# EAGLE design ch37x-cart (EAGLE 9.6.2)
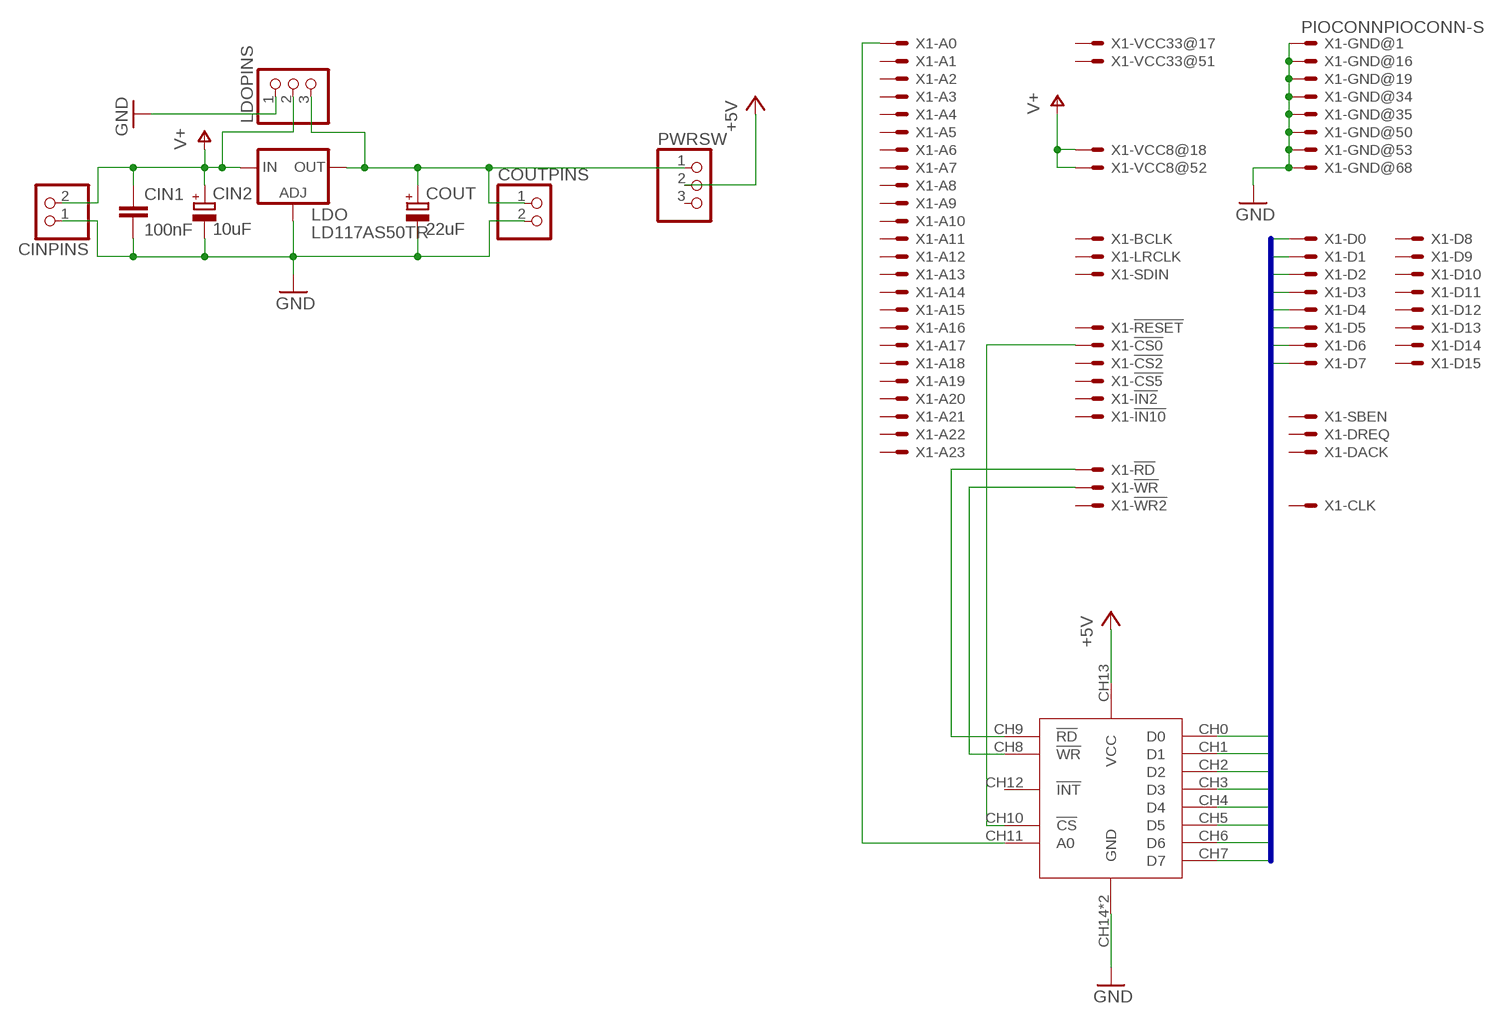
[diagram p0: schematic, sheet 1]

## Parts
CH37XBOARD  CH375B-BOARD  [CH375B-BOARD]
CIN1  100nF  C-EUC0603K  [C0603K]
CIN2  10uF  CPOL-EUA/3216-18W  [A/3216-18W]
CINPINS  PINHD-1X2  [1X02]
COUT  22uF  CPOL-EUA/3216-18W  [A/3216-18W]
COUTPINS  PINHD-1X2  [1X02]
LDO  LD117AS50TR  [SOT223]
LDOPINS  PINHD-1X3  [1X03]
PWRSW  PINHD-1X3  [1X03]
X1  PIOCONNPIOCONN-S  [PIOCONN]

## Nets
5VALWAYS: COUT.+ COUTPINS.1 LDO.4(OUT) LDOPINS.3 PWRSW.1
!CS0: CH37XBOARD.CH10(!CS) X1.4
!RD: CH37XBOARD.CH9(!RD) X1.30
!WR: CH37XBOARD.CH8(!WR) X1.64
+5V: CH37XBOARD.CH13(VCC) PWRSW.2
A0: CH37XBOARD.CH11(A0) X1.14
D0: CH37XBOARD.CH0(D0) X1.6
D1: CH37XBOARD.CH1(D1) X1.40
D2: CH37XBOARD.CH2(D2) X1.7
D3: CH37XBOARD.CH3(D3) X1.41
D4: CH37XBOARD.CH4(D4) X1.8
D5: CH37XBOARD.CH5(D5) X1.42
D6: CH37XBOARD.CH6(D6) X1.9
D7: CH37XBOARD.CH7(D7) X1.43
GND: CH37XBOARD.CH14(GND) CH37XBOARD.CH15(GND) CIN1.2 CIN2.- CINPINS.1 COUT.- COUTPINS.2 LDO.1(ADJ) LDOPINS.1 X1.1 X1.16 X1.19 X1.34 X1.35 X1.50 X1.53 X1.68
V+: CIN1.1 CIN2.+ CINPINS.2 LDO.3(IN) LDOPINS.2 X1.18 X1.52
Unconnected: CH37XBOARD.CH12(!INT) PWRSW.3 X1.2 X1.3 X1.5 X1.10 X1.11 X1.12 X1.13 X1.15 X1.17 X1.20 X1.21 X1.22 X1.23 X1.24 X1.25 X1.26 X1.27 X1.28 X1.29 X1.31 X1.32 X1.33 X1.36 X1.37 X1.38 X1.39 X1.44 X1.45 X1.46 X1.47 X1.48 X1.49 X1.51 X1.54 X1.55 X1.56 X1.57 X1.58 X1.59 X1.60 X1.61 X1.62 X1.63 X1.65 X1.66 X1.67

## Buses
D0,D1,D2,D3,D4,D5,D6,D7

## Library data of the parts
CH37XBOARD = pixel:CH375B-BOARD
CIN1 = rcl:C-EU: CAPACITOR, European symbol; SPICEPREFIX: C
CIN2 COUT = rcl:CPOL-EU: POLARIZED CAPACITOR, European symbol; SPICEPREFIX: C
CINPINS COUTPINS = pinhead:PINHD-1X2: PIN HEADER
LDO = v-reg:LD117A?*: Low drop fixed and adjustable positive voltage regulators 1 A Source: http://www.st.com/stonline/products/literature/ds/7194/ld1117axx.pdf
LDOPINS PWRSW = pinhead:PINHD-1X3: PIN HEADER
X1 = pixel:PIOCONN: CONNECTOR 68-pin 1.27mm (.050 inch) pitch SCSI+ unshielded receptacle right angle all plastic

## Board
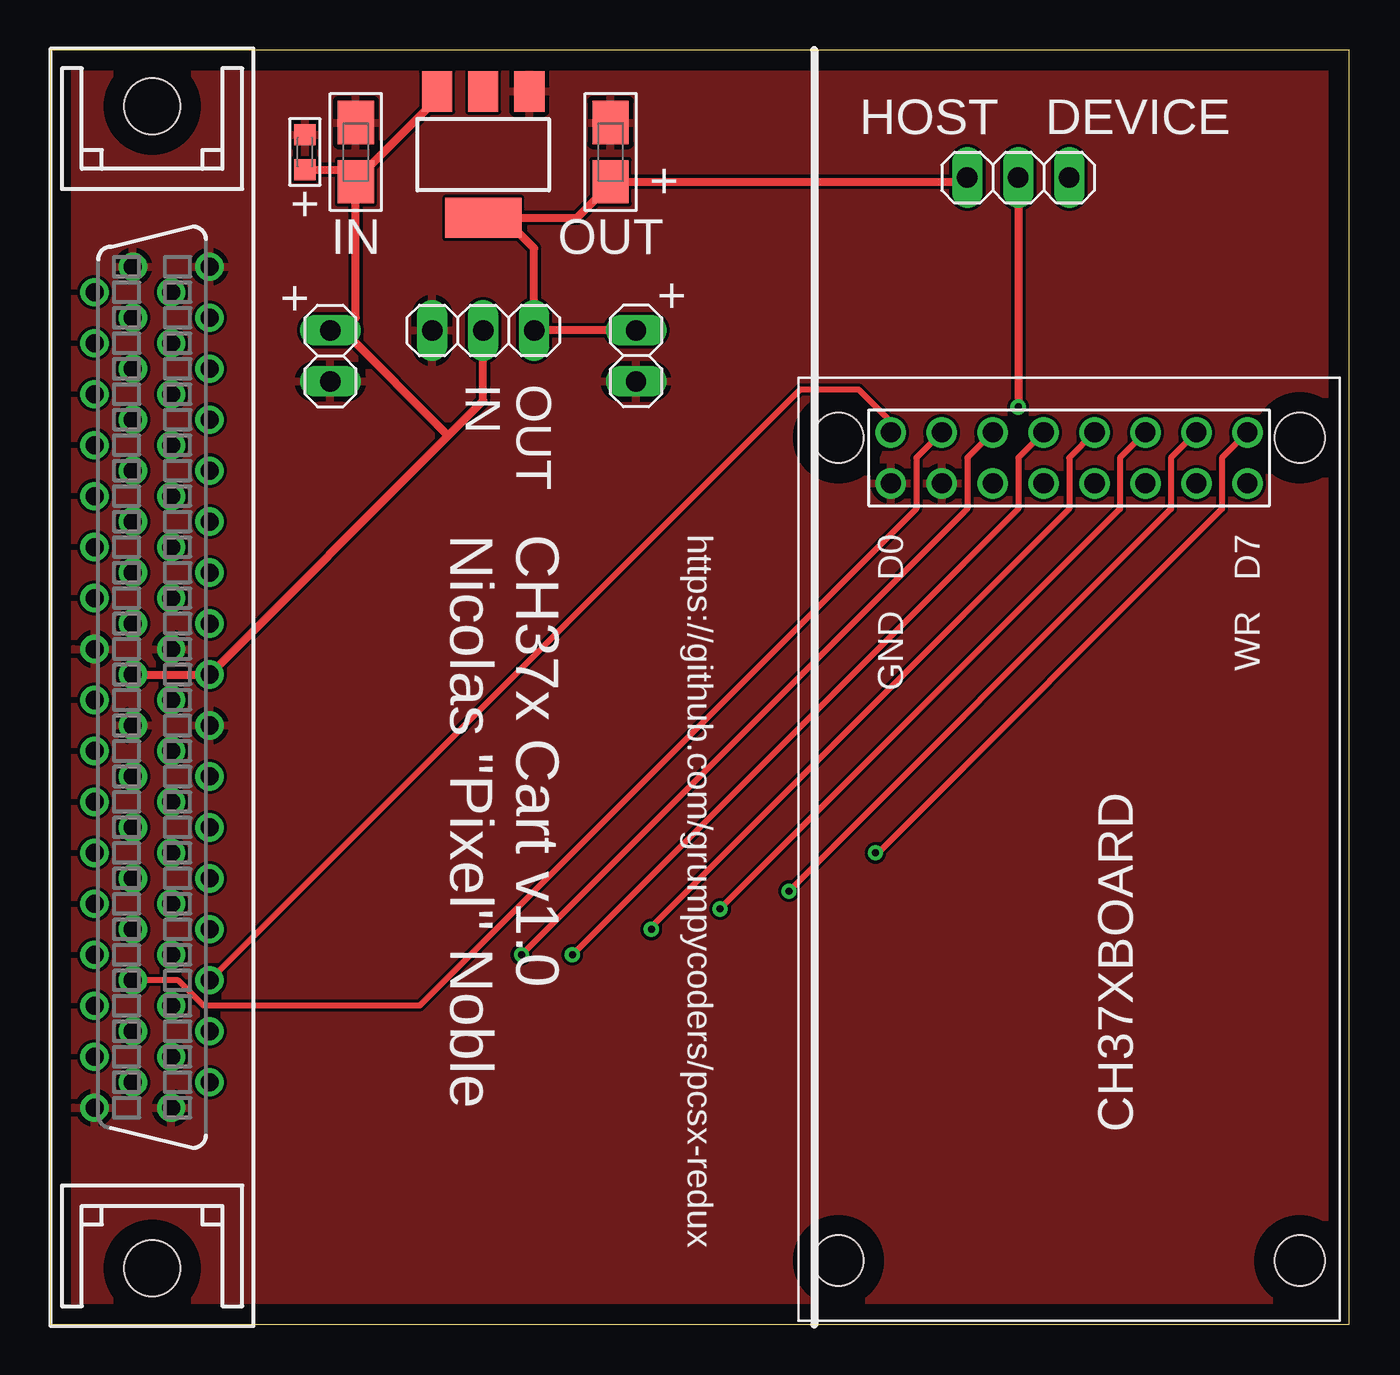
[diagram p1: board, top side]
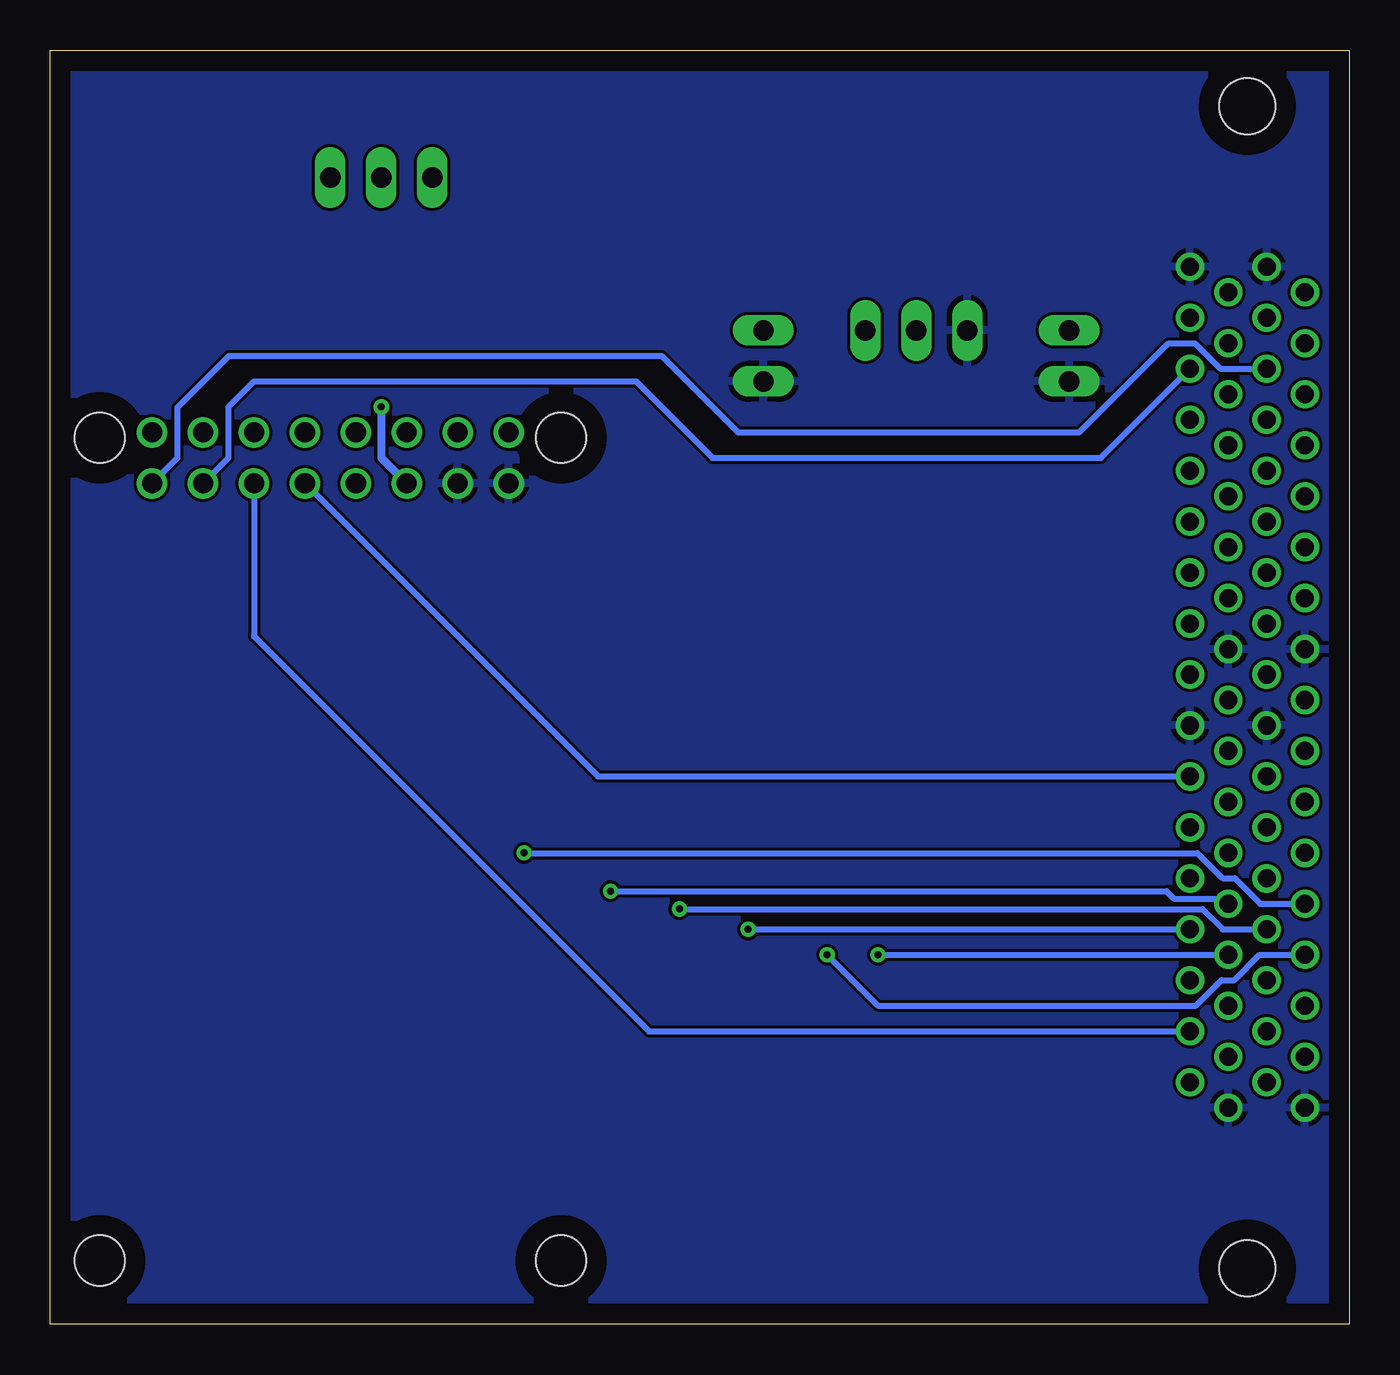
[diagram p2: board, bottom side, seen from below]

Size 64.77 x 63.5 mm. Coordinates in mm from the lower left corner, seen from the top.
Outline: 0,0 64.77,0 64.77,63.5 0,63.5 0,0
Copper layers (1*16): Top 0.035mm / dielectric 1.5mm / Bottom 0.035mm
Design rules "default": minimum track width 6mil, minimum drill 0.35mm, track to track 6mil, track to pad 6mil, pad to pad 6mil, via to via 6mil, smd to smd 6mil, copper to edge 40mil, drill to drill 6mil, minimum pad ring 10mil, minimum via ring 8mil, stop-mask expansion 4mil, vias tented up to drill 0mil, thermal gap 10mil

### Footprints (pad centres in the part's own frame; a part is rotated, then mirrored left to right if it is on the bottom)
CH375B-BOARD = drill 1: CH0 -1.27,-8.89; CH1 -1.27,-6.35; CH2 -1.27,-3.81; CH3 -1.27,-1.27; CH4 -1.27,1.27; CH5 -1.27,3.81; CH6 -1.27,6.35; CH7 -1.27,8.89; CH8 1.27,8.89; CH9 1.27,6.35; CH10 1.27,3.81; CH11 1.27,1.27; CH12 1.27,-1.27; CH13 1.27,-3.81; CH14 1.27,-6.35; CH15 1.27,-8.89 | hole 2.5: -1,11.5; -1,-11.5; 40,11.5; 40,-11.5
C0603K = smd 1.05 x 1.08: 1 -0.875,0; 2 0.875,0
A/3216-18W = smd 2.15 x 1.8: + 1.475,0; - -1.475,0
1X02 = drill 1.016 long: 1 -1.27,0; 2 1.27,0
SOT223 = smd 1.5 x 2: 1 -2.3,-3.15; 2 0,-3.15; 3 2.3,-3.15 | smd 3.8 x 2: 4 0,3.15
1X03 = drill 1.016 long: 1 -2.54,0; 2 0,0; 3 2.54,0
PIOCONN = drill 0.9 pad 1.27: 1 20.955,0.953; 2 19.685,2.863; 3 18.415,0.953; 4 17.145,2.863; 5 15.875,0.953; 6 14.605,2.863; 7 13.335,0.953; 8 12.065,2.863; 9 10.795,0.953; 10 9.525,2.863; 11 8.255,0.953; 12 6.985,2.863; 13 5.715,0.953; 14 4.445,2.863; 15 3.175,0.953; 16 1.905,2.863; 17 0.635,0.953; 18 -0.635,2.863; 19 -1.905,0.953; 20 -3.175,2.863; 21 -4.445,0.953; 22 -5.715,2.863; 23 -6.985,0.953; 24 -8.255,2.863; 25 -9.525,0.953; 26 -10.795,2.863; 27 -12.065,0.953; 28 -13.335,2.863; 29 -14.605,0.953; 30 -15.875,2.863; 31 -17.145,0.953; 32 -18.415,2.863; 33 -19.685,0.953; 34 -20.955,2.863; 35 20.955,-2.867; 36 19.685,-0.957; 37 18.415,-2.867; 38 17.145,-0.957; 39 15.875,-2.867; 40 14.605,-0.957; 41 13.335,-2.867; 42 12.065,-0.957; 43 10.795,-2.867; 44 9.525,-0.957; 45 8.255,-2.867; 46 6.985,-0.957; 47 5.715,-2.867; 48 4.445,-0.957; 49 3.175,-2.867; 50 1.905,-0.957; 51 0.635,-2.867; 52 -0.635,-0.957; 53 -1.905,-2.867; 54 -3.175,-0.957; 55 -4.445,-2.867; 56 -5.715,-0.957; 57 -6.985,-2.867; 58 -8.255,-0.957; 59 -9.525,-2.867; 60 -10.795,-0.957; 61 -12.065,-2.867; 62 -13.335,-0.957; 63 -14.605,-2.867; 64 -15.875,-0.957; 65 -17.145,-2.867; 66 -18.415,-0.957; 67 -19.685,-2.867; 68 -20.955,-0.957 | hole 2.8: -28.955,0; 28.955,0

### Placement (x,y rotation side)
CH37XBOARD  50.8,43.18 270 top
CIN1  12.7,58.42 90 top
CIN2  15.24,58.42 270 top
CINPINS  13.97,48.26 90 top
COUT  27.94,58.42 270 top
COUTPINS  29.21,48.26 270 top
LDO  21.59,58.29 180 top
LDOPINS  21.59,49.53 0 top
PWRSW  48.26,57.15 0 top
X1  5.08,31.75 270 top

### Tracks (layer width: path | path; a pad name or v marks a point on that pad's centre or on a via)
5VALWAYS
  Top 0.406: COUTPINS.1 LDOPINS.3 24.13,53.62 22.61,55.14 LDO.4 26.27,55.14 27.94,56.82 COUT.+ 45.72,56.95 PWRSW.1
!CS0
  Bottom 0.305: CH37XBOARD.CH10 54.61,34.29 34.92,14.61 X1.4
!RD
  Bottom 0.305: CH37XBOARD.CH9 55.88,43.18 55.88,45.72 54.61,46.99 35.56,46.99 31.75,43.18 12.39,43.18 X1.30
!WR
  Bottom 0.305: CH37XBOARD.CH8 58.42,43.18 58.42,45.69 55.85,48.26 34.29,48.26 30.48,44.45 13.46,44.45 9.02,48.89 7.71,48.89 6.44,47.62 X1.64
+5V  (via drill 0.35)
  Top 0.406: PWRSW.2 v48.26,45.72
  Bottom 0.406: v48.26,45.72 48.26,43.18 CH37XBOARD.CH13
A0
  Bottom 0.305: CH37XBOARD.CH11 37.47,27.3 X1.14
D0
  Top 0.305: X1.6 37.4,46.6 40.3,46.6 41.84,45.05 41.84,44.52 CH37XBOARD.CH0
D1
  Top 0.305: CH37XBOARD.CH1 43.18,43.18 43.18,40.64 18.42,15.88 7.65,15.88 6.39,17.14 X1.40
D2  (via drill 0.35)
  Top 0.305: CH37XBOARD.CH2 45.72,43.18 45.72,40.64 v23.5,18.41
  Bottom 0.305: v23.5,18.41 X1.7
D3  (via drill 0.35)
  Top 0.305: CH37XBOARD.CH3 48.26,43.18 48.26,40.64 v26.04,18.41
  Bottom 0.305: X1.41 4.48,18.41 5.74,17.15 6.38,17.15 7.65,15.88 23.5,15.88 v26.04,18.41
D4  (via drill 0.35)
  Top 0.305: CH37XBOARD.CH4 50.8,43.18 50.8,40.64 29.97,19.81 v29.97,19.68
  Bottom 0.305: v29.97,19.68 X1.8
D5  (via drill 0.35)
  Top 0.305: CH37XBOARD.CH5 53.34,43.18 53.34,40.64 v33.4,20.7
  Bottom 0.305: v33.4,20.7 v33.39,20.69 7.33,20.69 6.32,19.68 X1.42
D6  (via drill 0.35)
  Top 0.305: CH37XBOARD.CH6 55.88,43.18 55.88,40.64 v36.83,21.59
  Bottom 0.305: v36.83,21.59 9.12,21.59 8.74,21.22 6.29,21.22 X1.9
D7  (via drill 0.35)
  Top 0.305: CH37XBOARD.CH7 58.42,43.18 58.42,40.64 41.21,23.43 v41.15,23.5
  Bottom 0.305: v41.15,23.5 41.14,23.49 7.58,23.49 6.32,22.23 5.72,22.23 4.45,20.95 X1.43
GND
  pour Bottom: 0,63.5 64.77,63.5 64.77,0 0,0
  pour Top: 0,63.5 64.77,63.5 64.77,0 0,0
V+
  Top 0.406: X1.52 X1.18 19.85,44.29 | 19.85,44.29 21.59,46.03 LDOPINS.2 | CINPINS.2 14.61,49.53 | 14.61,49.53 19.85,44.29 | 14.61,49.53 15.24,50.16 CIN2.+ | CIN1.1 15.24,57.55 CIN2.+ | LDO.3 19.29,61.07 15.24,57.02 CIN2.+

### Text on the board
tPlace: HOST | DEVICE | + | + | IN | OUT | + | + | IN | OUT | CH37x Cart v1.0 / Nicolas "Pixel" Noble | https://github.com/grumpycoders/pcsx-redux